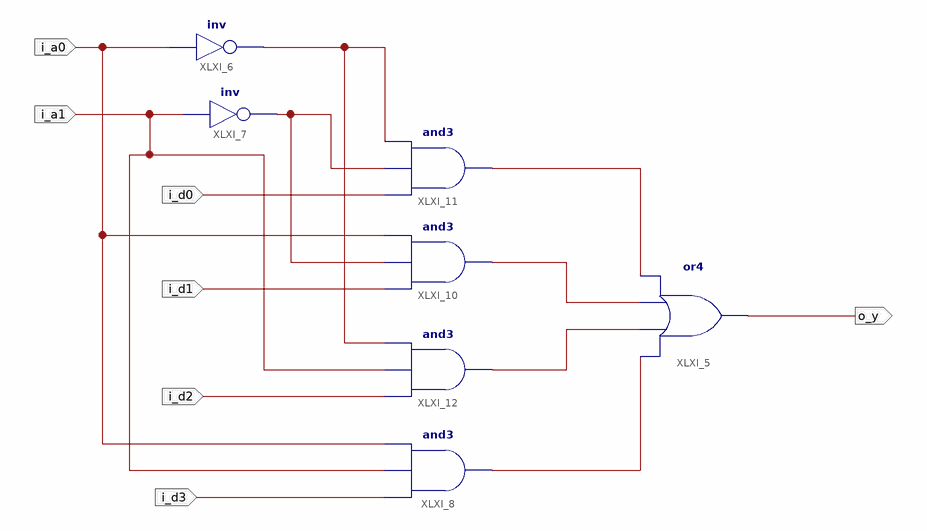
[diagram p0: schematic sheet 1]
// Xilinx ISE schematic Lab6.sch (spartan3e) as structural Verilog: 7 symbols, 7 ports
module Lab6 (
  input  i_d0,
  input  i_d1,
  input  i_d2,
  input  i_d3,
  input  i_a1,
  input  i_a0,
  output o_y
);

  wire XLXN_1, XLXN_2, XLXN_3, XLXN_4, XLXN_11, XLXN_13;

  or XLXI_5 (o_y, XLXN_4, XLXN_3, XLXN_2, XLXN_1);
  not XLXI_6 (XLXN_11, i_a0);
  not XLXI_7 (XLXN_13, i_a1);
  and XLXI_8 (XLXN_4, i_d3, i_a1, i_a0);
  and XLXI_10 (XLXN_2, i_d1, XLXN_13, i_a0);
  and XLXI_11 (XLXN_1, i_d0, XLXN_13, XLXN_11);
  and XLXI_12 (XLXN_3, i_d2, i_a1, XLXN_11);
endmodule
